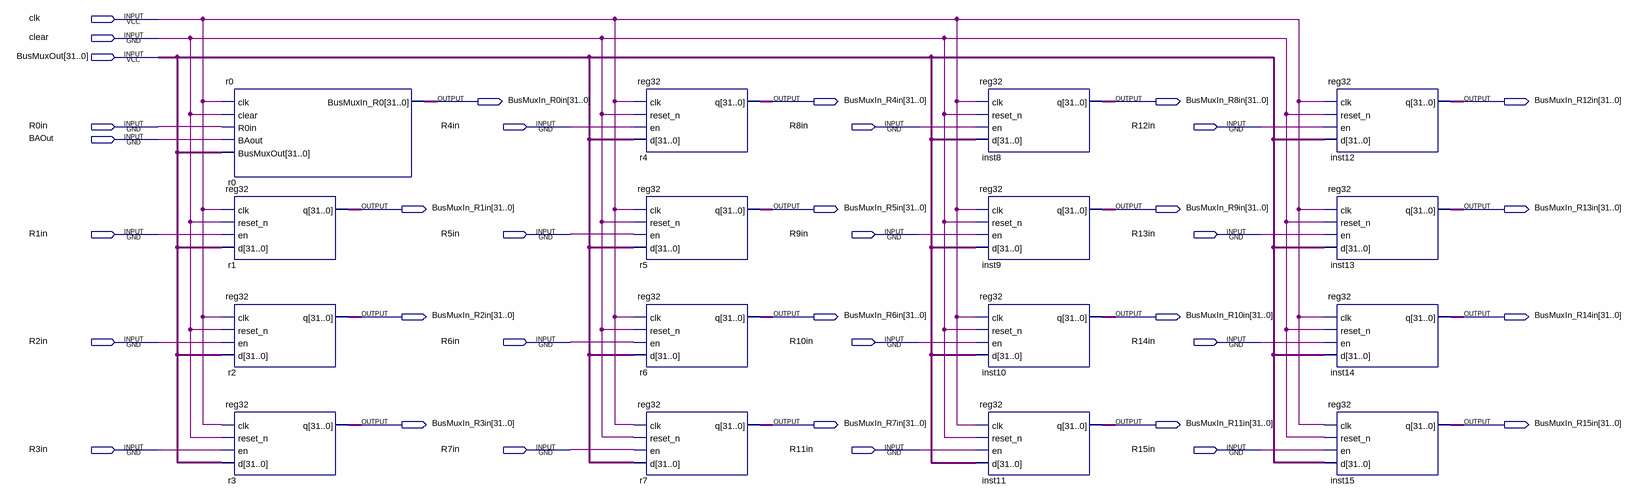
[diagram p0: schematic sheet]
// Quartus schematic gp_design.bdf as structural Verilog: 16 symbols, 36 pins
module gp_design (
  input  clk,
  input  clear,
  input  [31:0] BusMuxOut,
  input  R0in,
  input  R4in,
  input  R8in,
  input  R12in,
  input  BAOut,
  input  R1in,
  input  R5in,
  input  R9in,
  input  R13in,
  input  R2in,
  input  R6in,
  input  R10in,
  input  R14in,
  input  R3in,
  input  R7in,
  input  R11in,
  input  R15in,
  output [31:0] BusMuxIn_R0in,
  output [31:0] BusMuxIn_R4in,
  output [31:0] BusMuxIn_R8in,
  output [31:0] BusMuxIn_R12in,
  output [31:0] BusMuxIn_R1in,
  output [31:0] BusMuxIn_R5in,
  output [31:0] BusMuxIn_R9in,
  output [31:0] BusMuxIn_R13in,
  output [31:0] BusMuxIn_R2in,
  output [31:0] BusMuxIn_R6in,
  output [31:0] BusMuxIn_R10in,
  output [31:0] BusMuxIn_R14in,
  output [31:0] BusMuxIn_R3in,
  output [31:0] BusMuxIn_R7in,
  output [31:0] BusMuxIn_R11in,
  output [31:0] BusMuxIn_R15in
);

  r0 r0 (.clk(clk), .clear(clear), .R0in(R0in), .BAout(BAOut), .BusMuxOut(BusMuxOut), .BusMuxIn_R0(BusMuxIn_R0in));
  reg32 r1 (.clk(clk), .reset_n(clear), .en(R1in), .d(BusMuxOut), .q(BusMuxIn_R1in));
  reg32 r2 (.clk(clk), .reset_n(clear), .en(R2in), .d(BusMuxOut), .q(BusMuxIn_R2in));
  reg32 r3 (.clk(clk), .reset_n(clear), .en(R3in), .d(BusMuxOut), .q(BusMuxIn_R3in));
  reg32 r4 (.clk(clk), .reset_n(clear), .en(R4in), .d(BusMuxOut), .q(BusMuxIn_R4in));
  reg32 r5 (.clk(clk), .reset_n(clear), .en(R5in), .d(BusMuxOut), .q(BusMuxIn_R5in));
  reg32 r6 (.clk(clk), .reset_n(clear), .en(R6in), .d(BusMuxOut), .q(BusMuxIn_R6in));
  reg32 r7 (.clk(clk), .reset_n(clear), .en(R7in), .d(BusMuxOut), .q(BusMuxIn_R7in));
  reg32 inst8 (.clk(clk), .reset_n(clear), .en(R8in), .d(BusMuxOut), .q(BusMuxIn_R8in));
  reg32 inst9 (.clk(clk), .reset_n(clear), .en(R9in), .d(BusMuxOut), .q(BusMuxIn_R9in));
  reg32 inst10 (.clk(clk), .reset_n(clear), .en(R10in), .d(BusMuxOut), .q(BusMuxIn_R10in));
  reg32 inst11 (.clk(clk), .reset_n(clear), .en(R11in), .d(BusMuxOut), .q(BusMuxIn_R11in));
  reg32 inst12 (.clk(clk), .reset_n(clear), .en(R12in), .d(BusMuxOut), .q(BusMuxIn_R12in));
  reg32 inst13 (.clk(clk), .reset_n(clear), .en(R13in), .d(BusMuxOut), .q(BusMuxIn_R13in));
  reg32 inst14 (.clk(clk), .reset_n(clear), .en(R14in), .d(BusMuxOut), .q(BusMuxIn_R14in));
  reg32 inst15 (.clk(clk), .reset_n(clear), .en(R15in), .d(BusMuxOut), .q(BusMuxIn_R15in));
endmodule
